# Altium project Sensor.PrjPcb
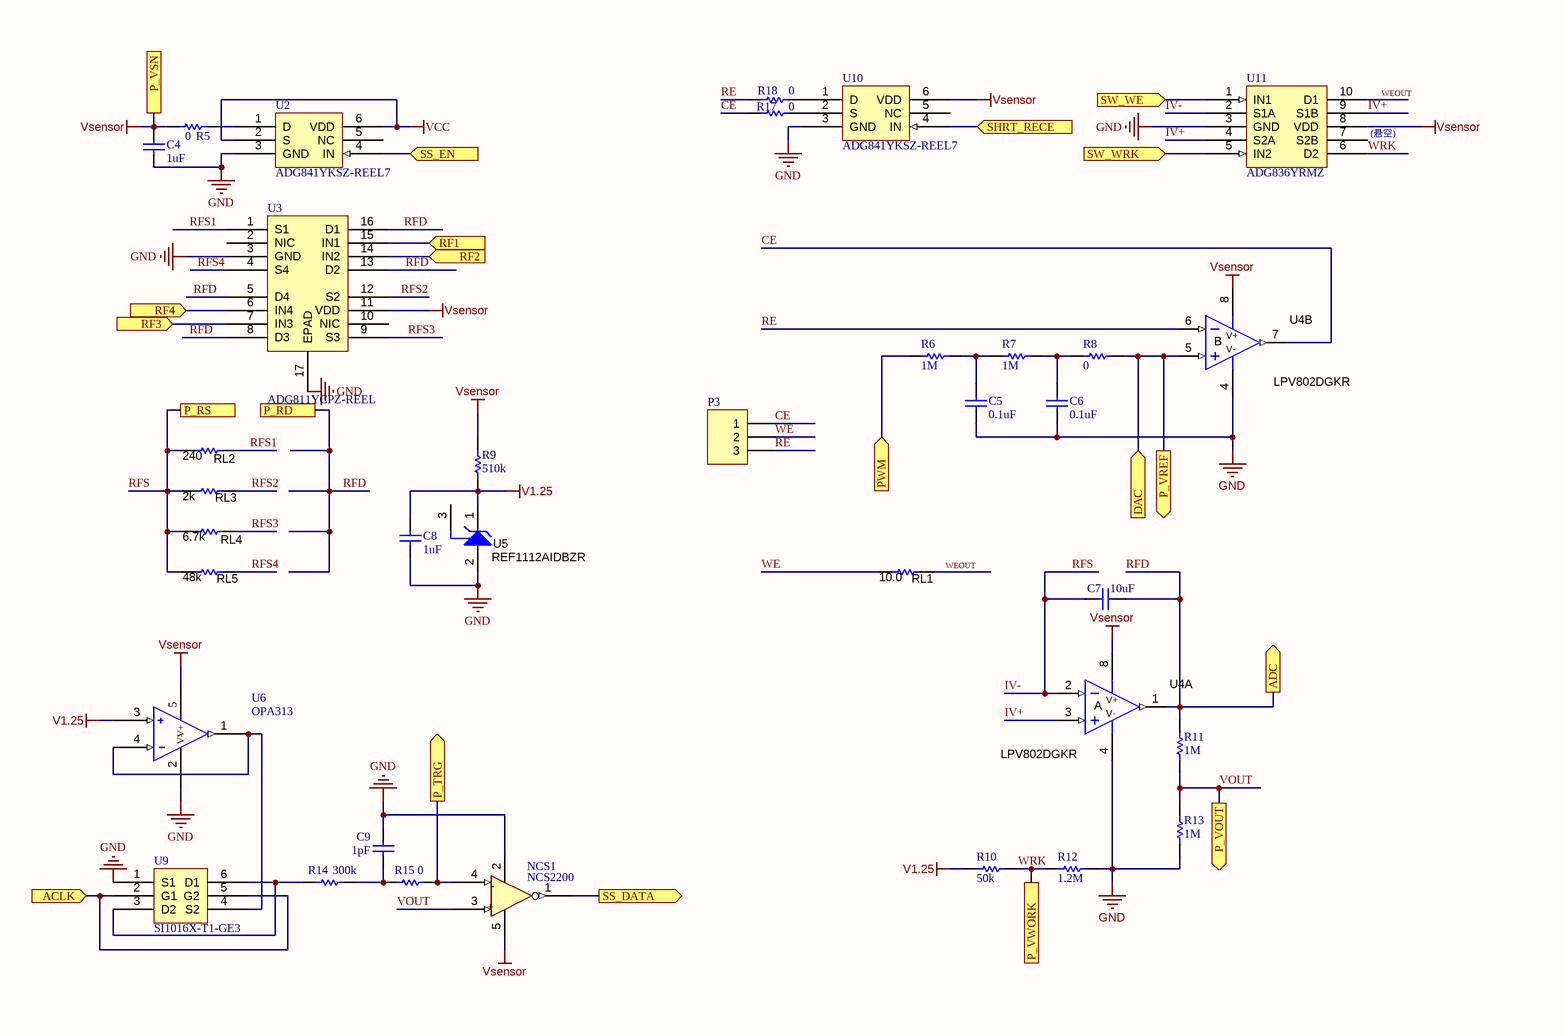
[diagram p0: SS.SchDoc]
2 sheets, 60 parts. Net scope: flat (ports and power ports of the same name join across sheets).
Board file: Sensor.PcbDoc
Sheets:
  SS.SchDoc
  AFE.SchDoc

## Sheet SS.SchDoc
size A4; SheetNumber: 2; SheetTotal: 3

### Parts
C4  value 1uF  [0402]
C5  value 0.1uF  [0402]
C6  value 0.1uF  [0402]
C7  value 10uF  [0402]
C8  value 1uF  [0402]
C9  value 1pF  [0805]
NCS1  NCS2200  [SC70-5]
P3  (no value)  [HDR1X3]
R5  value 0  [0402]
R6  value 1M  [0402]
R7  value 1M  [0402]
R8  value 0  [0402]
R9  value 510k  [0402]
R10  value 50k  [0402]
R11  value 1M  [0402]
R12  value 1.2M  [0402]
R13  value 1M  [0402]
R14  value 300k  [0805]
R15  value 0  [0402]
R17  value 0  [0402]
R18  value 0  [0402]
RL1  value 10.0  [0402]  (hidden comment: RT0402BRD0710RL)
RL2  value 240  [0402]  (hidden comment: RT0402BRD07240RL)
RL3  value 2k  [0402]  (hidden comment: RT0402BRD072KL)
RL4  value 6.7k  [0402]  (hidden comment: RT0402BRD076K7L)
RL5  value 48k  [0402]  (hidden comment: RT0402BRD0748KL)
U2  ADG841YKSZ-REEL7  [SOT65P210X110-6N]
U3  ADG811YCPZ-REEL  [QFN50P300X300X90-17N]
U4  LPV802DGKR  [DGK0008A_N]  (parts A,B of 2)
U5  REF1112AIDBZR  [DBZ0003A_N]
U6  OPA313  [SOT95P280X145-5N]
U9  SI1016X-T1-GE3  [SC-89-6 Vishay]
U10  ADG841YKSZ-REEL7  [SOT65P210X110-6N]
U11  ADG836YRMZ  [SOP50P490X110-10N]

### Ports
ACLK (in), ADC (out), DAC (in), P_RD, P_RS, P_TRG (out), P_VOUT (out), P_VREF (out), P_VSN, P_VWORK, PWM (in), RF1 (in), RF2 (in), RF3 (in), RF4 (in), SHRT_RECE (in), SS_DATA (out), SS_EN (in), SW_WE (in), SW_WRK (in)

### Nets
GND: C4.2 C5.2 C6.1 C8.1 C9.1 NCS1.2(GND) R12.2 R13.2 U2.3(GND) U3.3(GND) U3.17(EPAD) U4.4(V-) U5.2(GND) U6.2(V-) U9.1(S1) U10.3(GND) U11.3(GND)
V1.25: C8.2 R9.1 R10.1 U5.1(VO) U6.3
VCC: U2.2(S) U2.6(VDD)
Vsensor: C4.1 NCS1.5(VDD) R5.1 R9.2 U3.11(VDD) U4.8(V+) U6.5(V+) U10.6(VDD) U11.8(VDD) ; port P_VSN
CE: P3.1 R17.2 U4.7(OUT)
IV+: U4.3(IN+) U11.4(S2A) U11.9(S1B)
IV-: C7.2 RL2.1 RL3.1 RL4.1 RL5.1 U4.2(IN-) U11.2(S1A) ; port P_RS  [also labelled RFS]
RE: P3.3 R18.2 U4.6(IN-)
RFD: C7.1 R11.1 U3.5(D4) U3.8(D3) U3.13(D2) U3.16(D1) U4.1(OUT) ; port ADC, port P_RD
RFS1: RL2.2 U3.1(S1)
RFS2: RL3.2 U3.12(S2)
RFS3: RL4.2 U3.9(S3)
RFS4: RL5.2 U3.4(S4)
VOUT: NCS1.3(IN+) R11.2 R13.1 ; port P_VOUT
WE: P3.2 RL1.1
WEOUT: RL1.2 U11.10(D1)
WRK: R10.2 R12.1 U11.6(D2) ; port P_VWORK
NetC5_1: C5.1 R6.1 R7.2
NetC6_2: C6.2 R7.1 R8.1
NetC9_2: C9.2 R14.1 R15.2
NetNCS1_1: NCS1.1(OUT) ; port SS_DATA
NetNCS1_4: NCS1.4(In-) R15.1 ; port P_TRG
NetR5_2: R5.2 U2.1(D)
NetR6_2: R6.2 ; port PWM
NetR8_2: R8.2 U4.5(IN+) ; port DAC, port P_VREF
NetR14_2: R14.2 U9.3(D2) U9.6(D1)
NetR17_1: R17.1 U10.2(S)
NetR18_1: R18.1 U10.1(D)
NetU2_4: U2.4(IN) ; port SS_EN
NetU3_6: U3.6(IN4) ; port RF4
NetU3_7: U3.7(IN3) ; port RF3
NetU3_14: U3.14(IN2) ; port RF2
NetU3_15: U3.15(IN1) ; port RF1
NetU6_1: U6.1 U6.4 U9.4(S2)
NetU9_2: U9.2(G1) U9.5(G2) ; port ACLK
NetU10_4: U10.4(IN) ; port SHRT_RECE
NetU11_1: U11.1(IN1) ; port SW_WE
NetU11_5: U11.5(IN2) ; port SW_WRK

Not connected (* = marked no-connect by the designer): U2 5(NC); U3 2(NIC) 10(NIC); U5 3(NC); U10 5(NC); U11 7(S2B)

### Notes on the sheet
- (near U11) (悬空)
- DWG. NO.
- REV.
- SHT.
- THIS DOCUMENT AND THE DATA DISCLOSED HEREIN OR HEREWITH IS THE PROPERTY OF ALTIUM LIMITED AND MAY BE FREELY DISTRIBUTED IN WHOLE. NO RIGHTS ARE RESERVED OR EXPRESS OR IMPLIED WARANTEE GIVEN.
- REVISION
- DESCRIPTION
- DATE
- APPROVED
- ENG:
- APPROVALS
- PROJECT
- DSN:
- CHK:
- REFERENCE DOCUMENTS
- PROJECT REVISION:
- TITLE
- DOCUMENT REVISION:
- DESIGN ITEM:
- BOM:
- FAB DWG:
- PCB DWG:
- ASSY DWG:
- SCALE:
- SIZE
- B
- CAGE CODE
- FILE NAME
- DWG NO.
- SHEET
- OF
- REV
- (in symbol LPV802DGKR, part A) A
- (in symbol LPV802DGKR, part B) B
- (in symbol NCS2200) -; +

### Library data of the parts
C4-C9 = Cap: Ceramic Capacitor (Surface Mount); Manufacturer: Generic Ceramic Chip Cap (TBD); Digi-Key Part Number: *; Manufacturer Part Number: *; Note: *; Rating: *
NCS1 = NCS2200: Comparator: On Semi 10uA Comparator; Manufacturer: ON Semiconductor; Manufacturer Part Number: NCS2200SQ2T2G; Digi-Key Part Number: NCS2200SQ2T2GOSTR-ND; Rating: *; Value: *; Note: *
P3 = Header 3: Header, 3-Pin; LatestRevisionDate: 17-Jul-2002; LatestRevisionNote: Re-released for DXP Platform.; Publisher: Altium Limited
R5-R15 R17 R18 = Res: Chip Resistor (Surface Mount); Manufacturer: Generic Chip Res (TBD); Manufacturer Part Number: *; Digi-Key Part Number: *; Rating: *
RL1 = RT0402BRD0710RL: RES, 10.0, 0.1%, 0.1 W, 0402; Value2: 0.1W; Value1: 0.1%; ComponentLink1Description: Datasheet link; ComponentLink1URL: http://www.yageo.com/pdf/PYu-RT_1-to-0.05_RoHS_L_3.pdf
RL2 = RT0402BRD07240RL: RES, 240, 0.1%, 0.1 W, 0402; Value2: 0.1W; Value1: 0.1%; ComponentLink1Description: Datasheet link; ComponentLink1URL: http://www.yageo.com/pdf/PYu-RT_1-to-0.05_RoHS_L_3.pdf
RL3 = RT0402BRD072KL: RES, 2k, 0.1%, 0.1 W, 0402; Value2: 0.1W; Value1: 0.1%; ComponentLink1Description: Datasheet link; ComponentLink1URL: http://www.yageo.com/pdf/PYu-RT_1-to-0.05_RoHS_L_3.pdf
RL4 = RT0402BRD076K7L: RES, 6.7k, 0.1%, 0.1 W, 0402; Value2: 0.1W; Value1: 0.1%; ComponentLink1Description: Datasheet link; ComponentLink1URL: http://www.yageo.com/pdf/PYu-RT_1-to-0.05_RoHS_L_3.pdf
RL5 = RT0402BRD0748KL: RES, 48k, 0.1%, 0.1 W, 0402; Value2: 0.1W; Value1: 0.1%; ComponentLink1Description: Datasheet link; ComponentLink1URL: http://www.yageo.com/pdf/PYu-RT_1-to-0.05_RoHS_L_3.pdf
U2 U10 = ADG841YKSZ-REEL7: 单通道单刀单掷开关
U3 = ADG811YCPZ-REEL: 四通道单刀单掷开关
U4 = LPV802DGKR: 350 nA Rail-to-Rail I/O Nanopower Operational Amplifier Family, DGK0008A; Alternate PartNumber: LPV802DGKT; Manufacturer: Texas Instruments; CompType: IC; U/M: EA; SizeArea_mm2: 15.655; SizeAreaWB_mm2: 35.955; SizeX_mm: 5.05; SizeY_mm: 3.1; SizeZ_mm: 1.1; SymbolVersion: 2013-12-03; PartNumber: LPV802DGKR; PackageReference: DGK0008A; MountType: SMT; ComponentLink1Description: Datasheet Link; ComponentLink1URL: https://sps06.itg.ti.com/sites/KMS/crossdivteams/altium/docs/ComponentDatasheets/LPV80x_Prelim_20150508-1515_PPR.pdf; Publisher: Texas Instruments; LatestRevisionDate: 2016-06-15; Alternate Manufacturer: Texas Instruments; PackageDescription: VSSOP-8
U5 = REF1112AIDBZR: 1 uA Shunt Voltage Reference, 1.25 V, 10 ppm / degC, 5 mA, -40 to 85 degC, 3-pin SOT-23 (DBZ), Green (RoHS & no Sb/Br); Manufacturer: Texas Instruments; Alternate PartNumber: Equivalent; Initial Accuracy @ 25/deg C(%): 0.2; Iout/Iz(Max)(mA): 5; Min Iz for Regulation(uA): 1.2; Rating: Catalog; Temp Coeff(Max)(ppm/ degree C): 50; Temp Coeff(Typ)(ppm/ degree C): 10; VO(V): 1.25; DatasheetVersion: SBOS283C; PackageVersion: 4203227/B; PackageReference: DBZ0003A; PackageDescription: 3-Pin Plastic Small Outline, Body 2.92 x 1.3 mm, Pitch 0.95 mm; Supplier 1: Digi-Key; Supplier Part Number 1: REF1112AIDBZR-ND; Supplier 2: Newark; Supplier Part Number 2: 87H2545; Supplier 3: Mouser; Supplier Part Number 3: 595-REF1112AIDBZR; Eco-Plan: Green (RoHS & no Sb/Br); SubFamily: Shunt Voltage Reference; MountType: SMT; Code_JEDEC: TO-236; ComponentLink1Description: Manufacturer URL; ComponentLink1URL: http://www.ti.com/; ComponentLink2Description: Datasheet; ComponentLink2URL: http://www.ti.com/general/docs/lit/getliterature.tsp?genericPartNumber=REF1112&fileType=pdf; ComponentLink3Description: Package Specification; ComponentLink3URL: http://www.ti.com/litv/pdf/mpds108a; ComponentLink4Description: URL Link1; ComponentLink4URL: Samples URL:http://www.ti.com/product/ref1112; Alternate Manufacturer: Texas Instruments; PartNumber: REF1112AIDBZR
U6 = OPA313: 低功耗运算放大器
U9 = SI1016X-T1-GE3: N/P沟道增强型MOS管
U11 = ADG836YRMZ: 双通道单刀双掷开关

## Sheet AFE.SchDoc
size A4; SheetNumber: 3; SheetTotal: 3
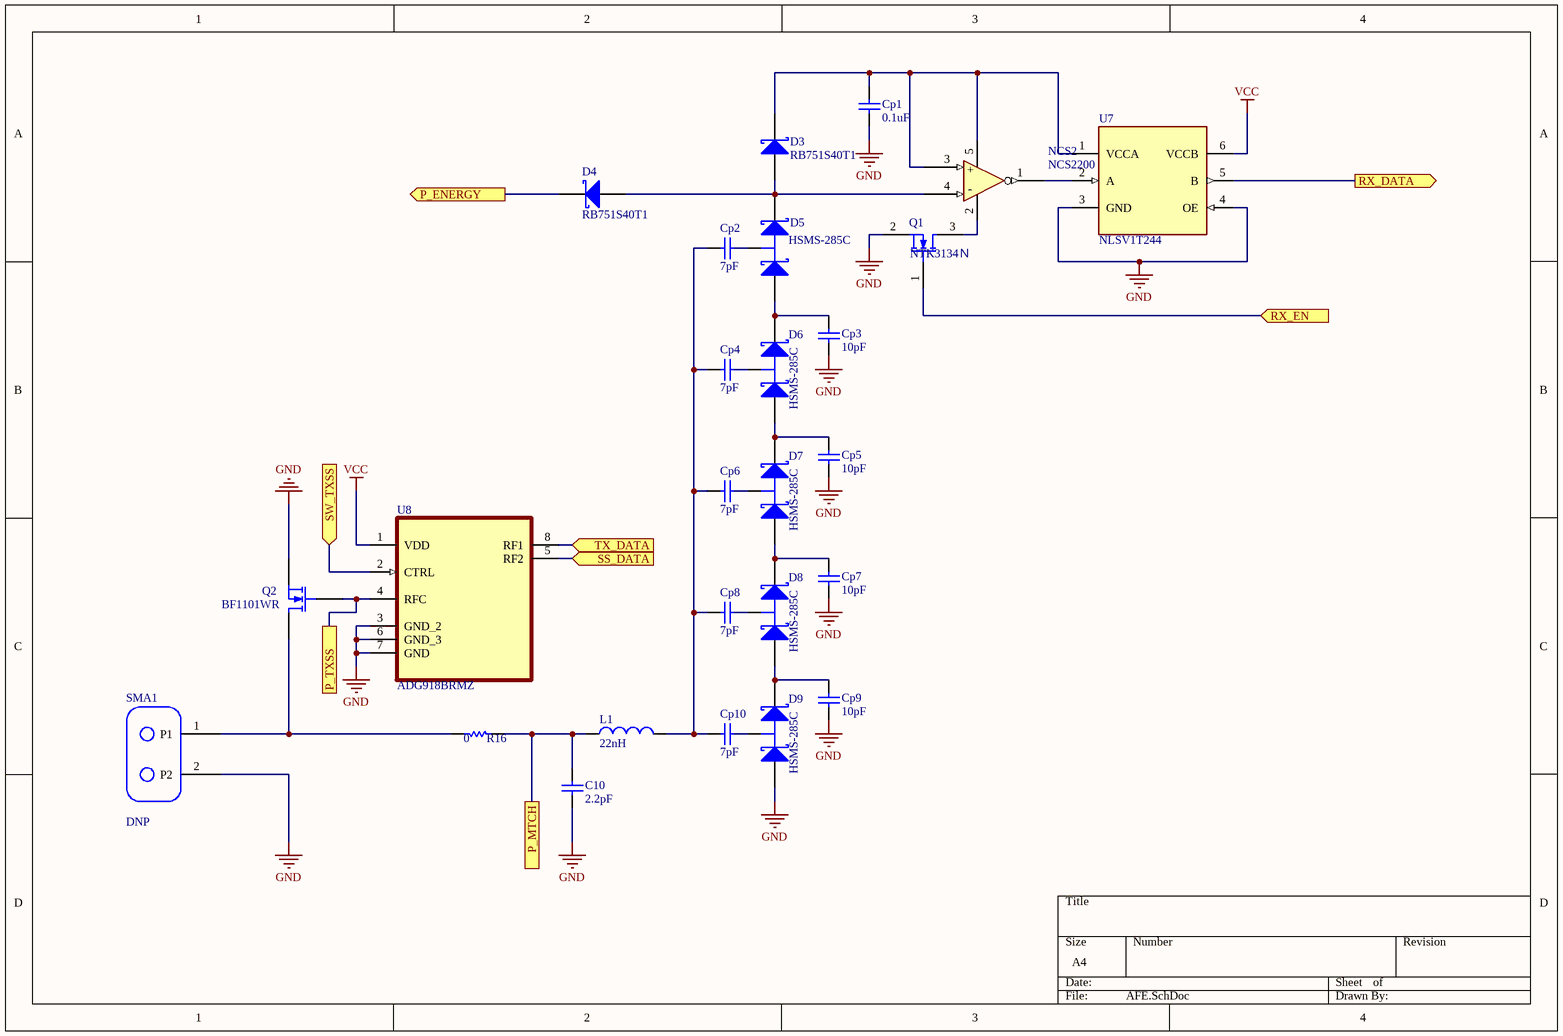
[diagram p1: AFE.SchDoc]

### Parts
C10  value 2.2pF  [0805]
Cp1  value 0.1uF  [0402]
Cp2  value 7pF  [0402]
Cp3  value 10pF  [0402]
Cp4  value 7pF  [0402]
Cp5  value 10pF  [0402]
Cp6  value 7pF  [0402]
Cp7  value 10pF  [0402]
Cp8  value 7pF  [0402]
Cp9  value 10pF  [0402]
Cp10  value 7pF  [0402]
D3  RB751S40T1  [SOD-523]
D4  RB751S40T1  [SOD-523]
D5  HSMS-285C  [SOT-323, HSMS-285C]
D6  HSMS-285C  [SOT-323, HSMS-285C]
D7  HSMS-285C  [SOT-323, HSMS-285C]
D8  HSMS-285C  [SOT-323, HSMS-285C]
D9  HSMS-285C  [SOT-323, HSMS-285C]
L1  value 22nH  [0805]
NCS2  NCS2200  [SC70-5]
Q1  NTK3134Ｎ  [SOT40P120X55-3N]
Q2  BF1101WR  [SOT343R]
R16  value 0  [0805]
SMA1  (no value)  [SMA - Hole - 2 Pin]
U7  NLSV1T244  [UDFN6]
U8  ADG918BRMZ  [SOP65P490X110-8N]

### Ports
P_ENERGY (out), P_MTCH, P_TXSS, RX_DATA (out), RX_EN (in), SS_DATA (in), SW_TXSS (in), TX_DATA (in)

### Nets
GND: C10.1 Cp1.2 Cp3.2 Cp5.2 Cp7.2 Cp9.2 D9.1(A) Q1.2(S) Q2.1(S) SMA1.2(P2) U7.3(GND) U7.4(OE) U8.3(GND_2) U8.6(GND_3) U8.7(GND)
VCC: U7.6(VCCB) U8.1(VDD)
NetC10_2: C10.2 L1.1 R16.1 ; port P_MTCH
NetCp1_1: Cp1.1 D3.1(C) NCS2.3(IN+) NCS2.5(VDD) U7.1(VCCA)
NetCp2_1: Cp2.1 D5.3(C)
NetCp2_2: Cp2.2 Cp4.2 Cp6.2 Cp8.2 Cp10.2 L1.2
NetCp3_1: Cp3.1 D5.1(A) D6.2(K)
NetCp4_1: Cp4.1 D6.3(C)
NetCp5_1: Cp5.1 D6.1(A) D7.2(K)
NetCp6_1: Cp6.1 D7.3(C)
NetCp7_1: Cp7.1 D7.1(A) D8.2(K)
NetCp8_1: Cp8.1 D8.3(C)
NetCp9_1: Cp9.1 D8.1(A) D9.2(K)
NetCp10_1: Cp10.1 D9.3(C)
NetD3_2: D3.2(A) D4.2(A) D5.2(K) NCS2.4(In-)
NetD4_1: D4.1(C) ; port P_ENERGY
NetNCS1_1: U8.5(RF2) ; port SS_DATA
NetNCS2_1: NCS2.1(OUT) U7.2(A)
NetNCS2_2: NCS2.2(GND) Q1.3(D)
NetQ1_1: Q1.1(G) ; port RX_EN
NetQ2_2: Q2.2(D) R16.2 SMA1.1(P1)
NetQ2_3: Q2.3(G) U8.4(RFC) ; port P_TXSS
NetU7_5: U7.5(B) ; port RX_DATA
NetU8_2: U8.2(CTRL) ; port SW_TXSS
NetU8_8: U8.8(RF1) ; port TX_DATA

### Notes on the sheet
- (in symbol NCS2200) +; -

### Library data of the parts
C10 = Cap: Ceramic Capacitor (Surface Mount); Manufacturer: Johanson; Manufacturer Part Number: 500R07S5R6CV4T; Digi-Key Part Number: 712-1289-1-ND; Note: *; Rating: *
Cp1-Cp10 = Cap: Ceramic Capacitor (Surface Mount); Manufacturer: Johanson; Manufacturer Part Number: 500R07S100JV4T; Digi-Key Part Number: 712-1253-1-ND; Note: *; Rating: *
D3 D4 = RB751S40T1: Schottky Diode; Published: 8-Jun-2000; LatestRevisionDate: 17-Jul-2002; LatestRevisionNote: Re-released for DXP Platform.; PackageReference: SMB; Publisher: Altium Limited; Code_JEDEC: DO-214-AA
D5-D9 = HSMS-285C: Agilent Schottky Diode, Two in Series, Small Package SOT-323; Manufacturer: Avago Technologies US Inc.; Manufacturer Part Number: HSMS-285C-BLKG; Note: *; Digi-Key Part Number: 516-2558-ND; Rating: *; Value: *
L1 = Ind: Inductor (Surface Mount); Manufacturer: Coilcraft (http://www.coilcraft.com/0402cs.cfm); Manufacturer Part Number: 0402CS-16NX_LU; Digi-Key Part Number: N/A; Rating: *; Note: *
NCS2 = NCS2200: as NCS1 on sheet SS; Digi-Key Part Number: NCS2200SQ2T2GOSTR-ND; Rating: *; Value: *; Note: *
Q2 = BF1101WR: N-Channel Dual-Gate Mos-Fets MOSFET, SOT343R; Manufacturer Part Number: BF1101WR,115; Manufacturer: NXP Semiconductors; Digi-Key Part Number: 568-6140-1-ND; Rating: *; Value: *; Note: *
R16 = Res: Chip Resistor (Surface Mount); Manufacturer: Panasonic; Manufacturer Part Number: ERJ-2RKF4702X; Digi-Key Part Number: P47.0KLCT-ND; Rating: *; Note: *
SMA1 = SMA - Hole - 2 Pin: Two pin SMA connector wisp; Note: This part is used to attach the antennae to WISP in the layout; DNP: DNP
U7 = NLSV1T244: Level Shifter: 1-Bit Dual-Supply Non-Inverting Level Translator; Manufacturer Part Number: NLSV1T244MUTBG; Manufacturer: ON Semiconductor; Digi-Key Part Number: NLSV1T244MUTBG-ND; Rating: *; Value: *; Note: *
U8 = ADG918BRMZ: RF Switch Single Pole 0 MHz to 4GHz 34dB 8-Pin MSOP; MF: Analog Devices; Value: *; SnapEDA_Link: https://www.snapeda.com/parts/ADG918BRMZ/Analog%20Devices%20Inc./view-part/239205/?ref=snap; Digi-Key_Part_Number: ADG918BRMZ-ND; Package: MSOP-8 Analog Devices; Digi-Key_Purchase_URL: https://www.digikey.ru/product-detail/en/analog-devices-inc/ADG918BRMZ/ADG918BRMZ-ND/820128?utm_source=snapeda&utm_medium=aggregator&utm_campaign=symbol; MP: ADG918BRMZ

## Nets that join several sheets
GND: SS (17 pins), AFE (15 pins)
VCC: SS (U2.2 U2.6), AFE (U7.6 U8.1)
NetNCS1_1: SS (NCS1.1), AFE (U8.5)